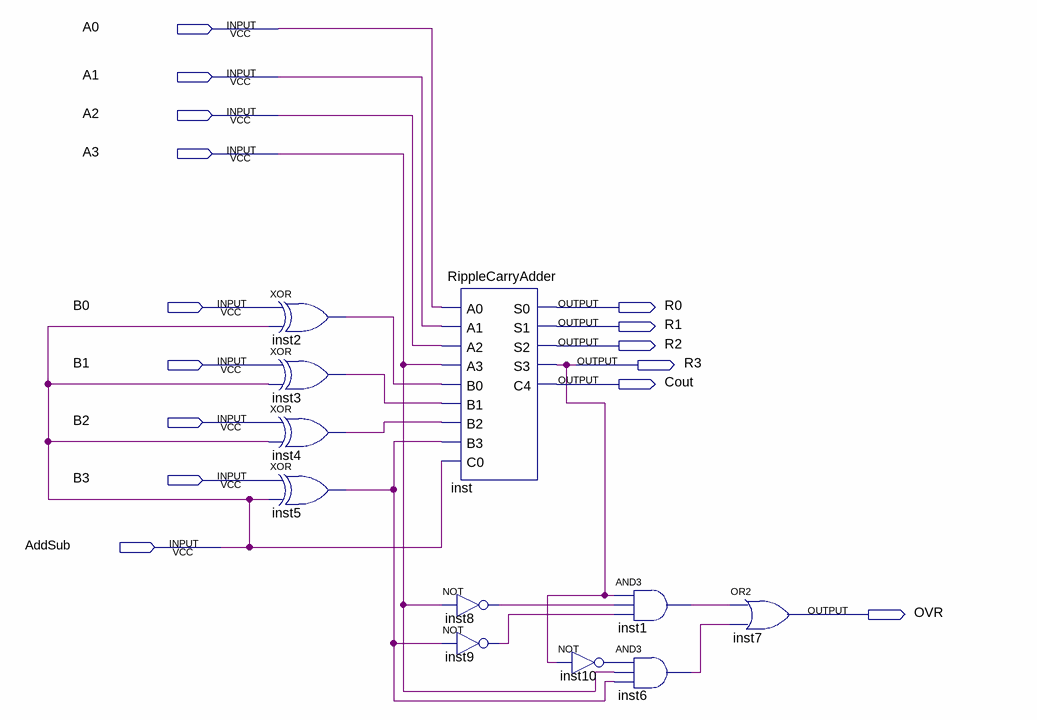
[diagram p0: schematic sheet]
// Quartus schematic AdderSubtractor.bdf as structural Verilog: 11 symbols, 15 pins
module AdderSubtractor (
  input  A0,
  input  A1,
  input  A2,
  input  A3,
  input  B0,
  input  B1,
  input  B2,
  input  B3,
  input  AddSub,
  output R0,
  output R1,
  output R2,
  output R3,
  output Cout,
  output OVR
);

  wire inst1_out, inst2_out, inst3_out, inst4_out, inst5_out, inst6_out, inst8_out, inst9_out, inst10_out;

  xor inst2 (inst2_out, B0, AddSub);
  xor inst3 (inst3_out, B1, AddSub);
  xor inst4 (inst4_out, B2, AddSub);
  xor inst5 (inst5_out, B3, AddSub);
  RippleCarryAdder inst (
    .A0(A0), .A1(A1), .A2(A2), .A3(A3), .B0(inst2_out), .B1(inst3_out), .B2(inst4_out), .B3(inst5_out),
    .C0(AddSub), .S0(R0), .S1(R1), .S2(R2), .S3(R3), .C4(Cout));
  not inst8 (inst8_out, A3);
  not inst9 (inst9_out, inst5_out);
  not inst10 (inst10_out, R3);
  and inst1 (inst1_out, R3, inst8_out, inst9_out);
  and inst6 (inst6_out, inst10_out, A3, inst5_out);
  or inst7 (OVR, inst1_out, inst6_out);
endmodule
